# EAGLE design teststecker (EAGLE 6.4)
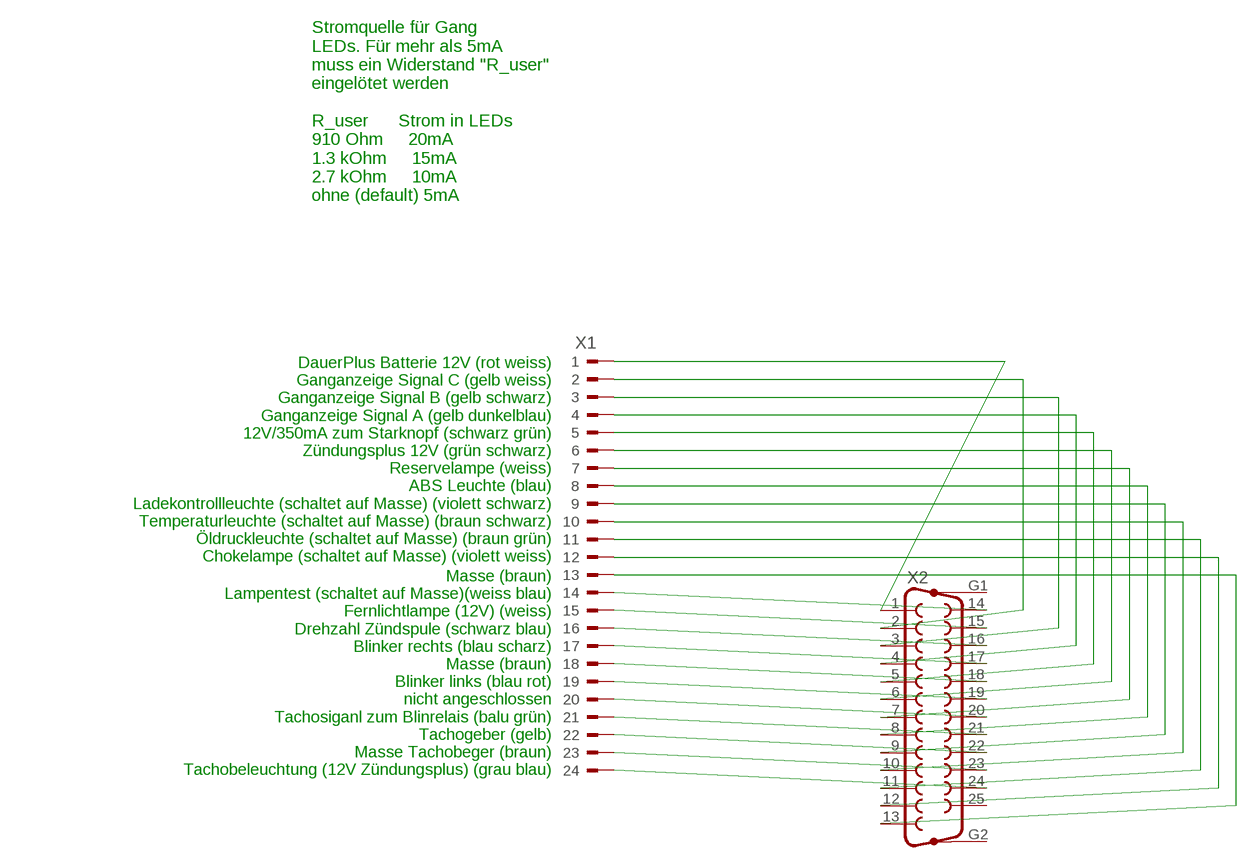
[diagram p0: schematic, sheet 1]

## Parts
X1  CON_BMW  [24-PIN]
X2  F25VP  [F25VP]

## Nets
N$1: X1.2 X2.2
N$2: X1.6 X2.6
N$3: X1.13 X2.13
N$4: X1.18 X2.18
N$5: X1.23 X2.23
N$6: X1.3 X2.3
N$7: X1.4 X2.4
N$8: X1.5 X2.5
N$9: X1.7 X2.7
N$10: X1.8 X2.8
N$11: X1.9 X2.9
N$12: X1.10 X2.10
N$13: X1.11 X2.11
N$14: X1.12 X2.12
N$15: X1.14 X2.14
N$16: X1.15 X2.15
N$17: X1.16 X2.16
N$18: X1.17 X2.17
N$19: X1.19 X2.19
N$20: X1.20 X2.20
N$21: X1.21 X2.21
N$22: X1.22 X2.22
N$23: X1.24 X2.24
N$110: X1.1 X2.1
Unconnected: X2.25 X2.G1 X2.G2

## Notes on the sheet
- Stromquelle für Gang 
  LEDs. Für mehr als 5mA
  muss ein Widerstand "R_user"
  eingelötet werden 
  
  R_user      Strom in LEDs
  910 Ohm     20mA
  1.3 kOhm     15mA
  2.7 kOhm     10mA
  ohne (default) 5mA
- DauerPlus Batterie 12V (rot weiss)
  Ganganzeige Signal C (gelb weiss)
  Ganganzeige Signal B (gelb schwarz)
  Ganganzeige Signal A (gelb dunkelblau)
  12V/350mA zum Starknopf (schwarz grün)
  Zündungsplus 12V (grün schwarz)
  Reservelampe (weiss)
  ABS Leuchte (blau)
  Ladekontrollleuchte (schaltet auf Masse) (violett schwarz)
  Temperaturleuchte (schaltet auf Masse) (braun schwarz)
  Öldruckleuchte (schaltet auf Masse) (braun grün)
  Chokelampe (schaltet auf Masse) (violett weiss)
- Masse (braun)
  Lampentest (schaltet auf Masse)(weiss blau)
  Fernlichtlampe (12V) (weiss)
  Drehzahl Zündspule (schwarz blau)
  Blinker rechts (blau scharz)
  Masse (braun)
  Blinker links (blau rot)
  nicht angeschlossen
  Tachosiganl zum Blinrelais (balu grün)
  Tachogeber (gelb)
  Masse Tachobeger (braun)
  Tachobeleuchtung (12V Zündungsplus) (grau blau)

## Library data of the parts
X1 = con_BMW:CON_BMW: BMW CONNECTOR
X2 = con-subd:F25VP: SUB-D; OC_FARNELL: unknown; OC_NEWARK: unknown

## Board
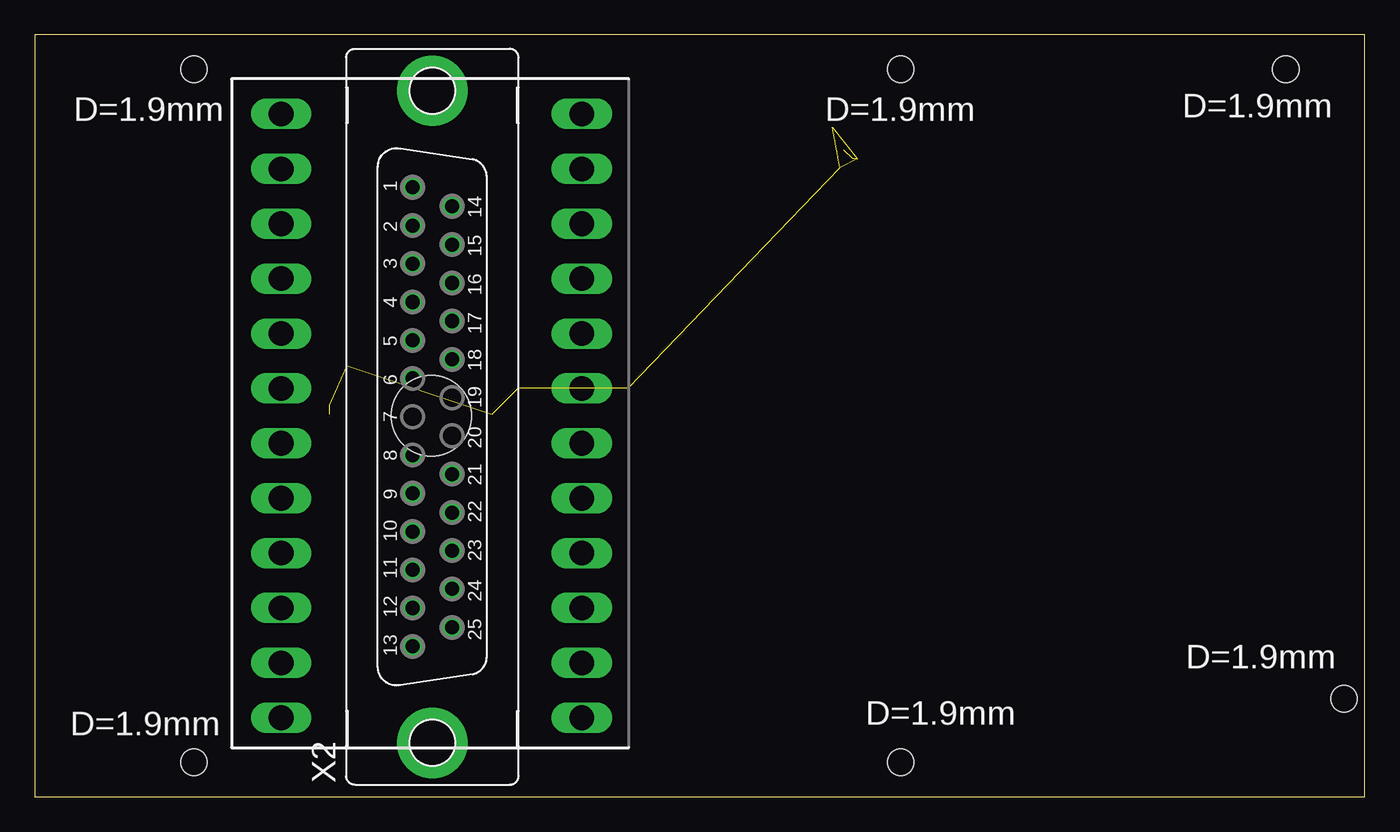
[diagram p1: board, top side]
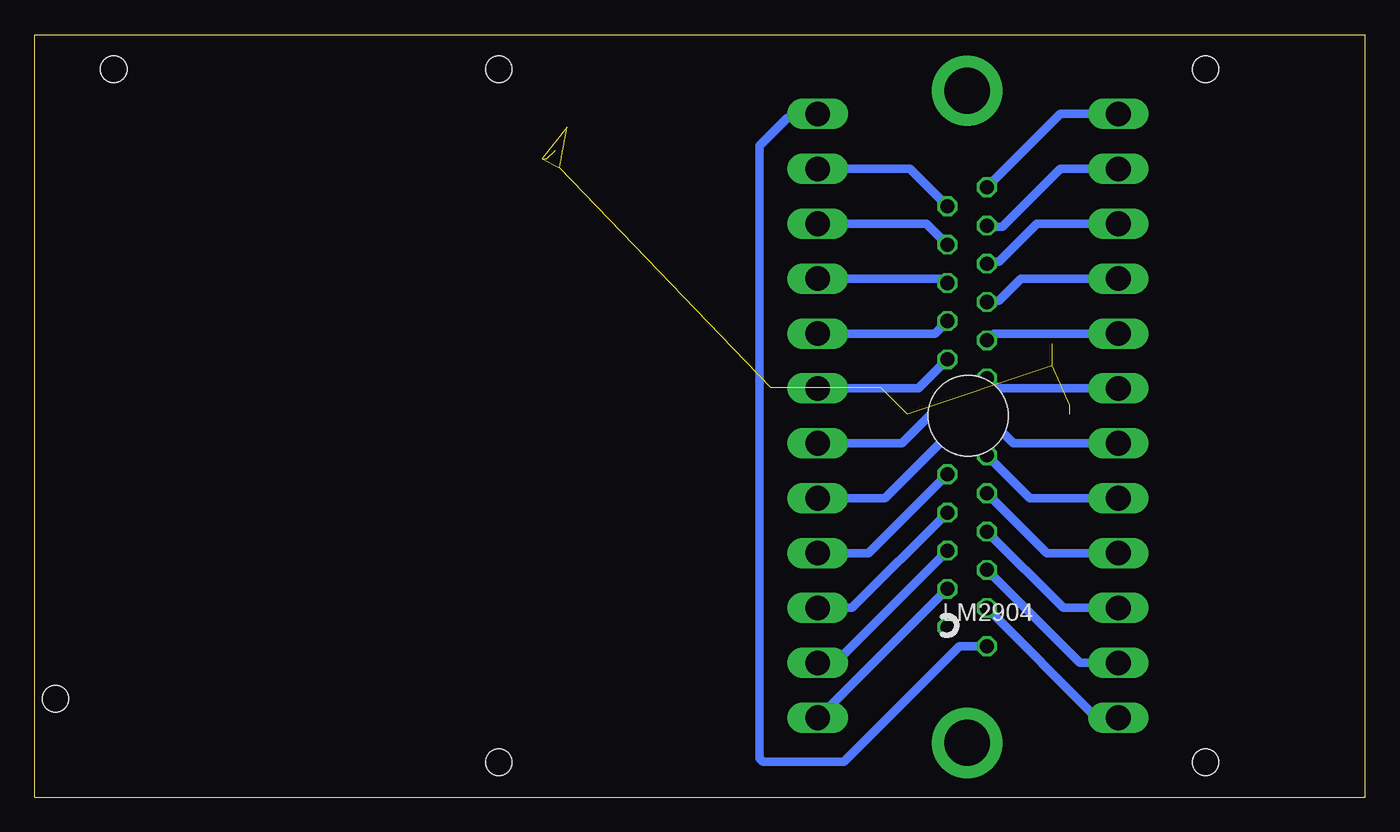
[diagram p2: board, bottom side, seen from below]

Size 96 x 55 mm. Coordinates in mm from the lower left corner, seen from the top.
Outline: 96,55 0,55 0,0 96,0 96,55
Copper layers (1*16): Top 0.035mm / dielectric 1.5mm / Bottom 0.035mm
Design rules "multi-cb_035um-cu *": minimum track width 6mil, minimum drill 12mil, track to track 16mil, track to pad 20mil, pad to pad 16mil, via to via 16mil, smd to smd 16mil, copper to edge 20mil, drill to drill 8mil, minimum pad ring 8mil, minimum via ring 6mil, stop-mask expansion 3mil, vias tented up to drill 0mil, thermal gap 8mil
Holes 5.8 mm at 28.64,27.5
Holes 1.91 mm at 11.5,52.5 62.5,52.5 11.5,2.5 62.5,2.5 90.3,52.5 94.5,7.1

### Footprints (pad centres in the part's own frame; a part is rotated, then mirrored left to right if it is on the bottom)
24-PIN = drill 1.778 long: 1 -21.78,-10.85; 2 -17.82,-10.85; 3 -13.86,-10.85; 4 -9.9,-10.85; 5 -5.94,-10.85; 6 -1.98,-10.85; 7 1.98,-10.85; 8 5.94,-10.85; 9 9.9,-10.85; 10 13.86,-10.85; 11 17.82,-10.85; 12 21.78,-10.85; 13 -21.78,10.85; 14 -17.82,10.85; 15 -13.86,10.85; 16 -9.9,10.85; 17 -5.94,10.85; 18 -1.98,10.85; 19 1.98,10.85; 20 5.94,10.85; 21 9.9,10.85; 22 13.86,10.85; 23 17.82,10.85; 24 21.78,10.85
F25VP = drill 1.016 octagon: 1 16.561,1.422; 2 13.792,1.422; 3 11.049,1.422; 4 8.28,1.422; 5 5.512,1.422; 6 2.769,1.422; 7 0,1.422; 8 -2.769,1.422; 9 -5.512,1.422; 10 -8.28,1.422; 11 -11.049,1.422; 12 -13.792,1.422; 13 -16.561,1.422; 14 15.189,-1.422; 15 12.421,-1.422; 16 9.652,-1.422; 17 6.909,-1.422; 18 4.14,-1.422; 19 1.372,-1.422; 20 -1.372,-1.422; 21 -4.14,-1.422; 22 -6.909,-1.422; 23 -9.652,-1.422; 24 -12.421,-1.422; 25 -15.189,-1.422 | drill 3.302 pad 5.08: G1 -23.52,0; G2 23.52,0

### Placement (x,y rotation side)
X1  28.64,27.5 270 top
X2  28.7,27.43 90 top

### Tracks (layer width: path | path; a pad name or v marks a point on that pad's centre or on a via)
GND  (16 unrouted)
N$1
  Bottom 0.61: X1.2 21.99,45.32 26.16,41.15 27.2,41.15 X2.2
N$2
  Bottom 0.61: X1.6 26.56,29.48 X2.6
N$3
  Bottom 0.61: X2.13 29.26,10.87 37.59,2.54 43.43,2.54 43.69,2.79 43.69,46.99 41.66,49.02 39.74,49.02 X1.13
N$4
  Bottom 0.61: X1.18 32.22,29.48 X2.18
N$5
  Bottom 0.61: X1.23 38.22,9.68 X2.23
N$6
  Bottom 0.61: X1.3 23.66,41.36 26.42,38.61 27.15,38.61 X2.3
N$7
  Bottom 0.61: X1.4 24.83,37.4 26.42,35.81 27.18,35.81 X2.4
N$8
  Bottom 0.61: X1.5 26.78,33.44 X2.5
N$9
  Bottom 0.61: X1.7 25.37,25.52 X2.7
N$10
  Bottom 0.61: X1.8 24.18,21.56 X2.8
N$11
  Bottom 0.61: X1.9 22.96,17.6 X2.9
N$12
  Bottom 0.61: X1.10 21.77,13.64 X2.10
N$13
  Bottom 0.61: X1.11 20.58,9.68 X2.11
N$14
  Bottom 0.61: X1.12 19.36,5.72 X2.12
N$15
  Bottom 0.61: X1.14 32.82,45.32 X2.14
N$16
  Bottom 0.61: X1.15 31.63,41.36 X2.15
N$17
  Bottom 0.61: X1.16 30.44,37.4 X2.16
N$18
  Bottom 0.61: X1.17 31.02,33.44 X2.17
N$19
  Bottom 0.61: X1.19 33.41,25.52 X2.19
N$20
  Bottom 0.61: X1.20 34.62,21.56 X2.20
N$21
  Bottom 0.61: X1.21 35.82,17.6 X2.21
N$22
  Bottom 0.61: X1.22 37.01,13.64 X2.22
N$23
  Bottom 0.61: X1.24 39.42,5.72 X2.24
N$110
  Bottom 0.61: X1.1 21.99,49.28 X2.1

### Text on the board
tPlace: D=1.9mm | D=1.9mm | D=1.9mm | D=1.9mm | D=1.9mm | D=1.9mm
bNames: LM2904
tDocu: +12v